# EAGLE design IM920Sender (EAGLE 9.1.3)
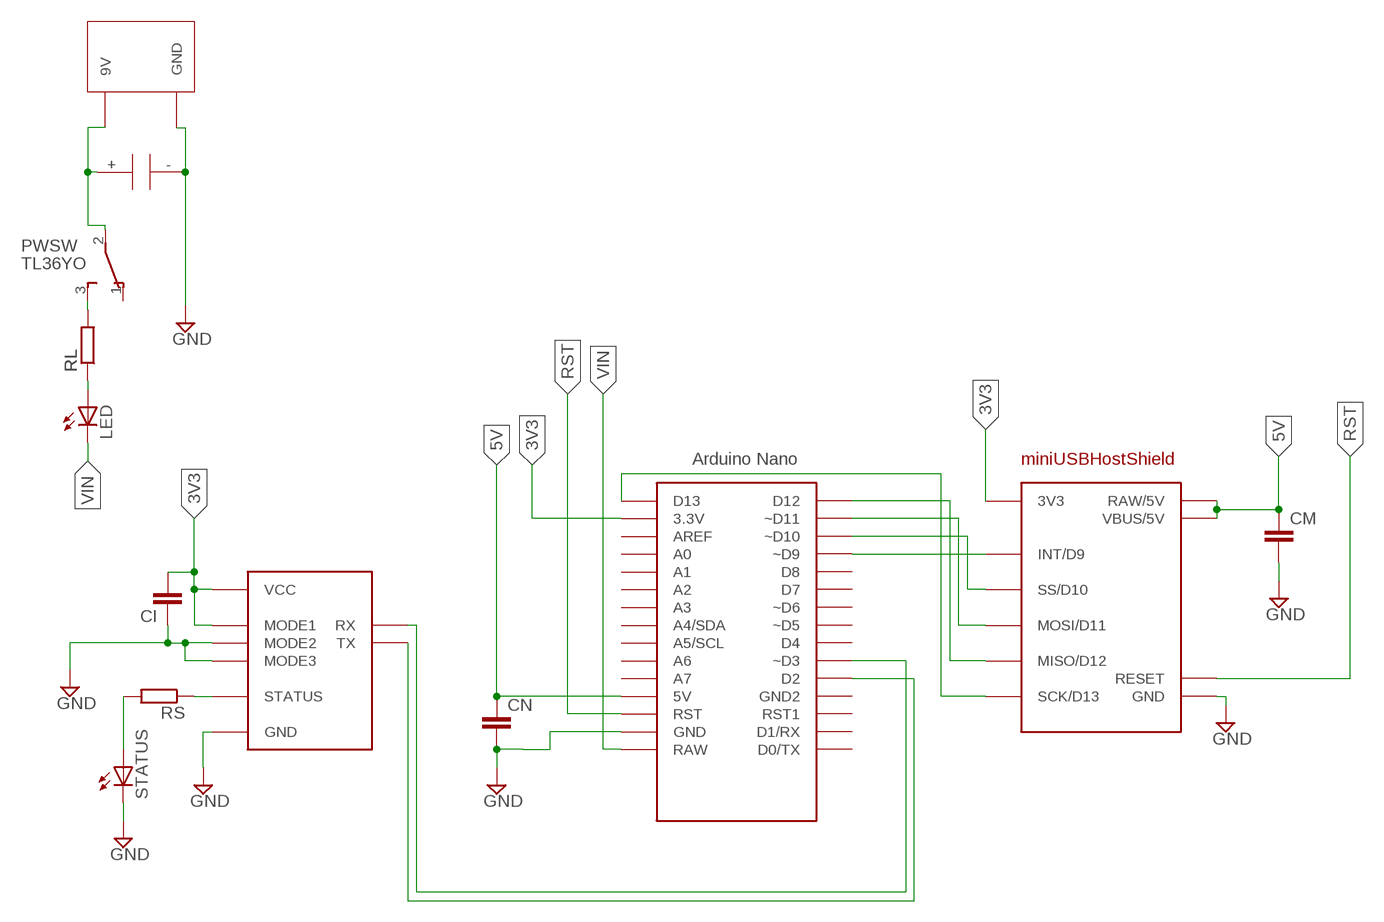
[diagram p0: schematic, sheet 1]

## Parts
CI  C2.5/2  [C2.5-2]
CM  C2.5/2  [C2.5-2]
CN  C2.5/2  [C2.5-2]
LED  LED3MM  [LED3MM]
PWSW  TL36YO  [TL3XYO]
RL  R-EU_0204/7  [0204/7]
RS  R-EU_0204/7  [0204/7]
STATUS  LED3MM  [LED3MM]
U$1  IM920  [IM920]
U$2  BH-9V-1P  [BH-9V-1P]
U$4  MINI-USBHOSTSHIELD  [USBMINI]
U$5  C-10U  [C-10U]
U$6  NANO  [NANO]

## Nets
3V3: CI.2 U$1.MODE1 U$1.VCC U$4.3V3 U$6.3.3V
5V: CM.1 CN.1 U$4.RAW(RAW/5V) U$4.VBUS(VBUS/5V) U$6.5V
GND: CI.1 CM.2 CN.2 STATUS.K(C) U$1.GND U$1.MODE2 U$1.MODE3 U$2.GND U$4.GND U$4.GND1(GND) U$5.- U$6.GND
N$1: RS.2 STATUS.A
N$2: RS.1 U$1.STATUS
N$3: PWSW.2(P) U$2.9V U$5.+
N$4: U$1.TX U$6.D2
N$5: U$4.INT(INT/D9) U$6.D9(~D9)
N$6: U$4.SS(SS/D10) U$6.D10(~D10)
N$7: U$4.MOSI(MOSI/D11) U$6.D11(~D11)
N$8: PWSW.3(S) RL.2
N$9: U$4.MISO(MISO/D12) U$6.D12
N$10: LED.A RL.1
N$11: U$4.SCK(SCK/D13) U$6.D13
N$14: U$1.RX U$6.D3(~D3)
RST: U$4.RESET U$6.RST
VIN: LED.K(C) U$6.RAW
Unconnected: PWSW.1(O) U$6.A0 U$6.A1 U$6.A2 U$6.A3 U$6.A4(A4/SDA) U$6.A5(A5/SCL) U$6.A6 U$6.A7 U$6.AREF U$6.D4 U$6.D5(~D5) U$6.D6(~D6) U$6.D7 U$6.D8 U$6.GND1(GND2) U$6.RST1 U$6.RX1(D1/RX) U$6.TX0(D0/TX)

## Library data of the parts
CI CM CN = capacitor-wima:C: CAPACITOR naming: grid - package width
LED STATUS = led:LED: LED OSRAM: - CHIPLED LG R971, LG N971, LY N971, LG Q971, LY Q971, LO R971, LY R971 LH N974, LH R974 LS Q976, LO Q976, LY Q976 LO Q996 - Hyper CHIPLED LW Q18S LB Q993, LB Q99A, LB R99A - SideLED LS A670, LO A670, LY A670, LG A670, LP A670 LB A673, LV A673, LT A673, LW A673 LH A674 LY A675 LS A676, LA A676, LO A676, LY A676, LW A676 LS A679, LY A679, LG A679 - Hyper Micro SIDELED® LS Y876, LA Y876, LO Y876, LY Y876 LT Y87S - SmartLED LW L88C, LW L88S LB L89C, LB L89S, LG L890 LS L89K, LO L89K, LY L89K LS L896, LA L896, LO L896, LY L896 - TOPLED LS T670, LO T670, LY T670, LG T670, LP T670 LSG T670, LSP T670, LSY T670, LOP T670, LYG T670 LG T671, LOG T671, LSG T671 LB T673, LV T673, LT T673, LW T673 LH T674 LS T676, LA T676, LO T676, LY T676, LB T676, LH T676, LSB T676, LW T676 LB T67C, LV T67C, LT T67C, LS T67K, LO T67K, LY T67K, LW E67C LS E67B, LA E67B, LO E67B, LY E67B, LB E67C, LV E67C, LT E67C LW T67C LS T679, LY T679, LG T679 LS T770, LO T770, LY T770, LG T770, LP T770 LB T773, LV T773, LT T773, LW T773 LH T774 LS E675, LA E675, LY E675, LS T675 LS T776, LA T776, LO T776, LY T776, LB T776 LHGB T686 LT T68C, LB T68C - Hyper Mini TOPLED® LB M676 - Mini TOPLED Santana® LG M470 LS M47K, LO M47K, LY M47K Source: http://www.osram.convergy.de LUXEON: - LUMILED® LXK2-PW12-R00, LXK2-PW12-S00, LXK2-PW14-U00, LXK2-PW14-V00 LXK2-PM12-R00, LXK2-PM12-S00, LXK2-PM14-U00 LXK2-PE12-Q00, LXK2-PE12-R00, LXK2-PE12-S00, LXK2-PE14-T00, LXK2-PE14-U00 LXK2-PB12-K00, LXK2-PB12-L00, LXK2-PB12-M00, LXK2-PB14-N00, LXK2-PB14-P00, LXK2-PB14-Q00 LXK2-PR12-L00, LXK2-PR12-M00, LXK2-PR14-Q00, LXK2-PR14-R00 LXK2-PD12-Q00, LXK2-PD12-R00, LXK2-PD12-S00 LXK2-PH12-R00, LXK2-PH12-S00 LXK2-PL12-P00, LXK2-PL12-Q00, LXK2-PL12-R00 Source: www.luxeon.com KINGBRIGHT: KA-3528ASYC Source: www.kingbright.com
PWSW = switch:TL36YO: TINY SWITCH ON - ON Source: http://www2.produktinfo.conrad.com/datenblaetter/700000-724999/705152-da-01-de-Subminiaturschalter_TL_36YO.pdf
RL RS = rcl:R-EU_: RESISTOR, European symbol; SPICEPREFIX: R
U$1 = im920:IM920
U$2 = BH-9V-1P:BH-9V-1P: 9v battery holder
U$4 = miniUSBHostShield:MINI-USBHOSTSHIELD: mini usb host shield
U$5 = C-10uF:C-10U: 10uF
U$6 = Arduino:NANO: Arduino Nano

## Board
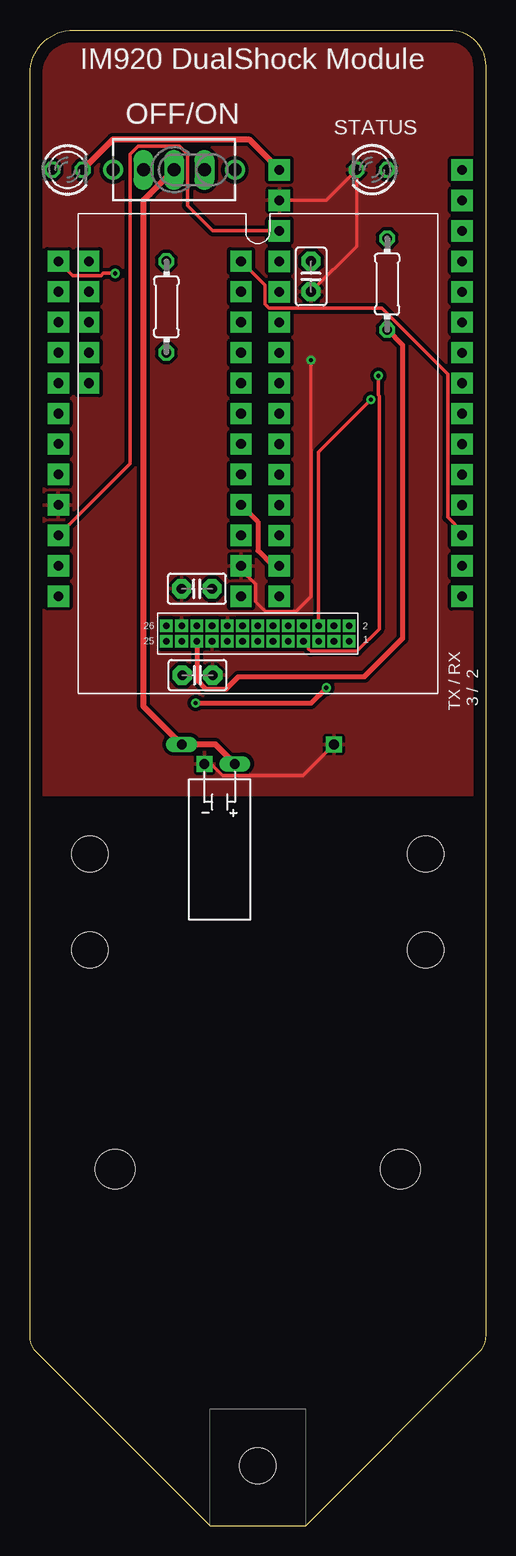
[diagram p1: board, top side]
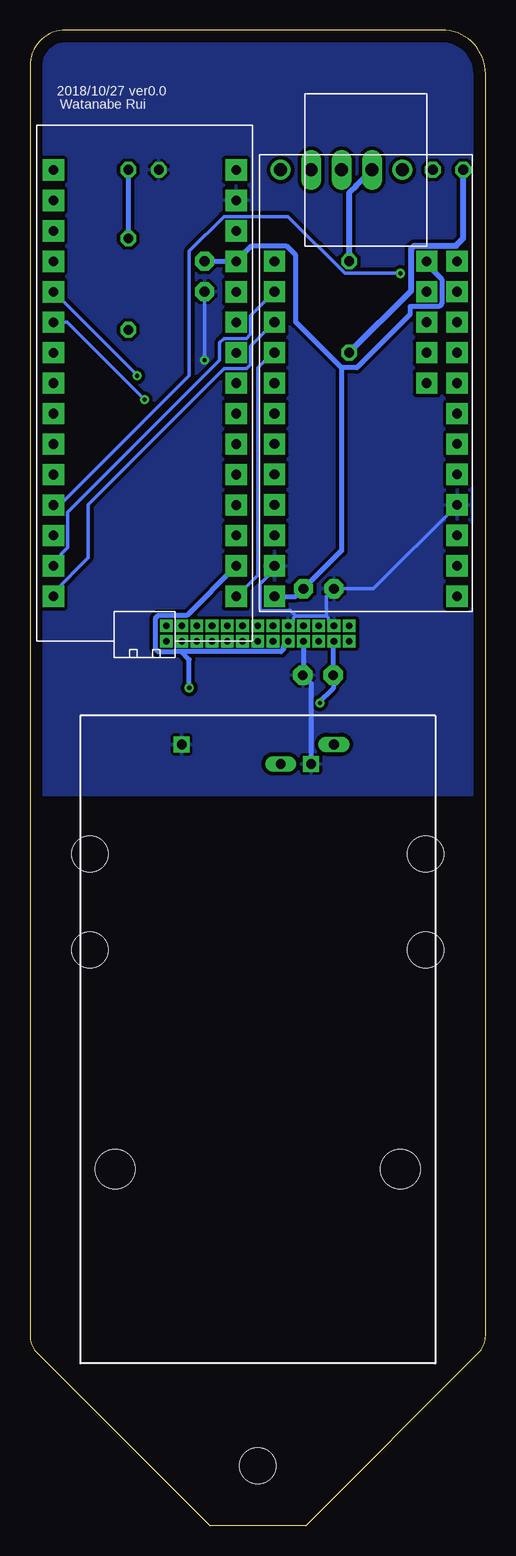
[diagram p2: board, bottom side, seen from below]

Size 38 x 124.69 mm. Coordinates in mm from the lower left corner, seen from the top.
Outline: 15,0 23,0 37.41,14.41 arc45 38,15.83 38,121.69 arc90 35,124.69 3.63,124.69 arc90 0,121.05 0,15.83 arc45 0.59,14.41 15,0
Copper layers (1*16): Top 0.035mm / dielectric 1.5mm / Bottom 0.035mm
Design rules "default": minimum track width 6mil, minimum drill 0.35mm, track to track 6mil, track to pad 6mil, pad to pad 6mil, via to via 6mil, smd to smd 6mil, copper to edge 40mil, drill to drill 6mil, minimum pad ring 10mil, minimum via ring 8mil, stop-mask expansion 4mil, vias tented up to drill 0mil, thermal gap 10mil
Holes 3 mm at 5,56 33,56 5,48 33,48 19,5

### Footprints (pad centres in the part's own frame; a part is rotated, then mirrored left to right if it is on the bottom)
C2.5-2 = drill 0.813 pad 1.6 octagon: 1 -1.27,0; 2 1.27,0
LED3MM = drill 0.813 octagon: A -1.27,0; K 1.27,0
TL3XYO = drill 1.1 pad 1.422 long: 1 -2.54,0; 2 0,0; 3 2.54,0 | drill 1.1 pad 1.676: M1 -5.08,0; M2 5.08,0
0204/7 = drill 0.813 octagon: 1 -3.81,0; 2 3.81,0
IM920 = drill 0.55 pad 1 square: GND -6.35,5.635; MODE1 -2.54,4.365; MODE2 -2.54,5.635; MODE3 -3.81,4.365; P$1 7.62,4.365; P$2 7.62,5.635; P$3 6.35,4.365; P$4 6.35,5.635; P$5 5.08,4.365; P$8 3.81,5.635; P$9 2.54,4.365; P$10 2.54,5.635; P$11 1.27,4.365; P$12 1.27,5.635; P$13 0,4.365; P$14 0,5.635; P$15 -1.27,4.365; P$16 -1.27,5.635; P$20 -3.81,5.635; P$22 -5.08,5.635; P$25 -7.62,4.365; P$26 -7.62,5.635; RX 5.08,5.635; STATUS -5.08,4.365; TX 3.81,4.365; VCC -6.35,4.365
BH-9V-1P = drill 0.8 long: 9V -6.35,2.4 | drill 0.8 pad 1.27 square: GND 6.35,2.4 | hole 3.3: -11.9,37.8; 11.9,37.8
USBMINI = drill 0.8 pad 1.778 square: 3V3 0,-7.62; GND 0,-2.54; GND1 -15.24,-7.62; INT -15.24,-27.94; MISO 0,-22.86; MOSI 0,-25.4; P$1 -12.7,-20.32; P$2 -12.7,-22.86; P$3 0,-5.08; P$4 -12.7,-25.4; P$5 0,-10.16; P$6 0,-12.7; P$7 0,-15.24; P$8 0,-17.78; P$9 -12.7,-17.78; P$13 -15.24,0; P$14 -15.24,-2.54; P$17 -15.24,-10.16; P$18 -15.24,-12.7; P$19 -15.24,-15.24; P$20 -15.24,-17.78; P$21 -15.24,-20.32; P$22 -15.24,-22.86; P$23 -15.24,-25.4; RAW 0,0; RESET -15.24,-5.08; SCK 0,-20.32; SS 0,-27.94; VBUS -12.7,-27.94
C-10U = drill 0.8 long: + -1.27,0 | drill 0.8 square: - 1.27,0
NANO = drill 0.8 pad 1.778 square: 3.3V -7.62,15.24; 5V -7.62,-10.16; A0 -7.62,10.16; A1 -7.62,7.62; A2 -7.62,5.08; A3 -7.62,2.54; A4 -7.62,0; A5 -7.62,-2.54; A6 -7.62,-5.08; A7 -7.62,-7.62; AREF -7.62,12.7; D2 7.62,-7.62; D3 7.62,-5.08; D4 7.62,-2.54; D5 7.62,0; D6 7.62,2.54; D7 7.62,5.08; D8 7.62,7.62; D9 7.62,10.16; D10 7.62,12.7; D11 7.62,15.24; D12 7.62,17.78; D13 -7.62,17.78; GND -7.62,-15.24; GND1 7.62,-10.16; RAW -7.62,-17.78; RST -7.62,-12.7; RST1 7.62,-12.7; RX1 7.62,-15.24; TX0 7.62,-17.78

### Placement (x,y rotation side)
CI  13.97,70.9 180 top
CM  13.92,78.11 180 top
CN  23.45,104.14 270 top
LED  3.12,113.03 0 top
PWSW  12.02,113.03 180 top
RL  11.38,101.6 90 top
RS  29.8,103.5 90 top
STATUS  28.52,113.03 180 top
U$1  19,69.37 0 top
U$2  19,67.52 180 bottom
U$4  17.6,77.47 180 bottom
U$5  15.82,63.5 180 top
U$6  28.42,95.24 180 bottom

### Tracks (layer width: path | path; a pad name or v marks a point on that pad's centre or on a via)
3V3  (via drill 0.35)
  Top 0.4: U$4.3V3 19,83.69 19,81.28 20.27,80 U$6.3.3V | v13.82,68.58 23.45,68.58 v24.71,69.85
  Bottom 0.152: 25.98,72.86 26.16,72.85
  Bottom 0.4: U$6.3.3V 24.91,75.89 27.26,75.89 | 27.26,75.89 27.3,75.89 27.5,75.68 27.5,73.06 27.3,72.86 27.24,72.86 27.23,72.85 26.16,72.85 | 16.85,73.35 16.85,73.06 | 16.85,73.06 17.05,72.86 | 17.05,72.86 25.35,72.86 | 25.35,72.86 25.98,72.86 | 27.26,75.89 | v13.82,68.58 13.92,68.58 12.7,69.8 CI.2 12.7,73.69 U$1.VCC | v24.71,69.85 24.71,72.22 25.35,72.86 | 17.05,72.86 16.85,73.06 | 16.85,73.06 16.85,73.35 | 16.85,73.35 U$1.MODE1
5V
  Bottom 0.4: U$4.VBUS 4.9,105.15 3.66,103.91 3.66,101.83 3.87,101.63 6.27,101.63 6.3,101.6 6.3,100.97 10.74,96.52 12.02,96.52 | 12.02,96.52 12.33,96.84 15.82,100.33 15.82,105.91 16.57,106.65 19.55,106.65 U$6.5V CN.1 | U$4.RAW 15.82,77.47 CM.1 12.02,81.28 12.02,96.52
GND  (via drill 0.35)
  Top 0.3: CN.2 27.26,106.68 STATUS.K 24.71,110.48 U$6.GND | v23.45,97.16 23.45,77.47 22.18,76.2 19.64,76.2 18.79,77.04 18.79,78.48 17.6,79.68 U$4.GND | U$5.- 15.09,63.5 16.05,62.54 22.77,62.54 U$2.GND
  Bottom 0.3: 13.27,75.84 13.09,75.66 13.09,75.45 U$1.GND | 15.82,75.84 15.84,75.84 16.02,75.66 16.02,75.45 U$1.MODE2 | 15.82,75.84 13.27,75.84 | U$4.GND1 9.35,78.11 CM.2 13.27,77.49 13.27,75.84 | 15.82,75.84 16.26,76.28 18.62,76.28 18.79,76.46 18.79,78.48 17.6,79.68 U$4.GND | CN.2 v23.45,97.16
  Bottom 0.4: U$5.- 14.55,70.21 CI.1 15.19,70.95 U$1.MODE3
  pour Bottom (isolate 0.3): -0.05,124.46 -0.05,60.96 38.05,60.96 38.05,124.46
  pour Top (isolate 0.3): -0.05,60.96 38.05,60.96 38.05,124.46 -0.05,124.46
N$1
  Bottom 0.4: STATUS.A RS.2
N$2
  Top 0.4: U$1.STATUS 13.92,70.48 14.66,69.75 16.35,69.75 17.39,70.78 27.91,70.78 31.06,73.94 31.06,98.42 RS.1
N$3
  Top 0.5: U$5.+ 15.47,65.12 U$2.9V 9.47,68.3 9.47,110.49 9.96,110.98 9.98,110.98 10.7,111.7 10.7,111.72 PWSW.2
N$4  (via drill 0.35)
  Top 0.3: v29.06,95.86 29.06,94.23 29.13,94.16 29.13,74.76 27.27,72.91 23.43,72.91 23.25,73.08 23.25,73.3 U$1.TX
  Bottom 0.152: 29.12,95.92 v29.06,95.86
  Bottom 0.3: U$6.D2 29.12,95.95 29.12,95.92
N$5  (via drill 0.35)
  Top 0.3: v7.11,104.39 6.09,104.39 5.92,104.22 3.55,104.22 U$4.INT
  Bottom 0.3: v7.11,104.39 11.74,104.39 16.46,109.12 19.77,109.12 19.79,109.14 21.81,109.14 24.71,106.23 24.71,95.89 35.52,85.08 U$6.D9
N$6
  Top 0.3: U$4.SS 19.61,103.4 19.61,101.85 19.94,101.52 29.34,101.52 34.85,96 34.85,84.07 36.04,82.88 U$6.D10
N$7
  Bottom 0.3: U$4.MOSI 19.61,100.86 19.61,99.31 19.94,98.98 21.81,98.98 22.18,98.61 22.18,97.16 34.85,84.48 34.85,81.53 36.04,80.34 U$6.D11
N$8
  Bottom 0.5: PWSW.3 10.79,111.72 10.79,111.7 11.38,111.1 RL.2
N$9
  Bottom 0.3: U$4.MISO 19.61,98.32 19.61,96.77 19.94,96.44 21.81,96.44 33.13,85.12 33.13,80.71 36.04,77.8 U$6.D12
N$10
  Bottom 0.5: LED.A 1.86,107.31 2.47,106.7 5.96,106.7 6.19,106.47 6.19,102.98 RL.1
N$11
  Bottom 0.3: U$6.D13 19,79.26 19,96.52 17.73,97.79 U$4.SCK
N$14  (via drill 0.35)
  Top 0.3: U$1.RX 24.08,89.51 v28.45,93.88
  Bottom 0.3: v28.45,93.88 34.89,100.33 U$6.D3
RST
  Top 0.3: U$4.RESET 8.35,88.53 8.35,114.32 9.01,114.98 12.48,114.98 13.14,114.32 13.14,110.05 15.25,107.94 U$6.RST
VIN
  Top 0.5: LED.K 6.94,115.57 18.25,115.57 U$6.RAW

### Text on the board
tPlace: IM920 DualShock Module | OFF/ON | TX / RX / 3 / 2
bPlace: 2018/10/27 ver0.0 | Watanabe Rui